# EAGLE schematic tyrmt (EAGLE 6.3)
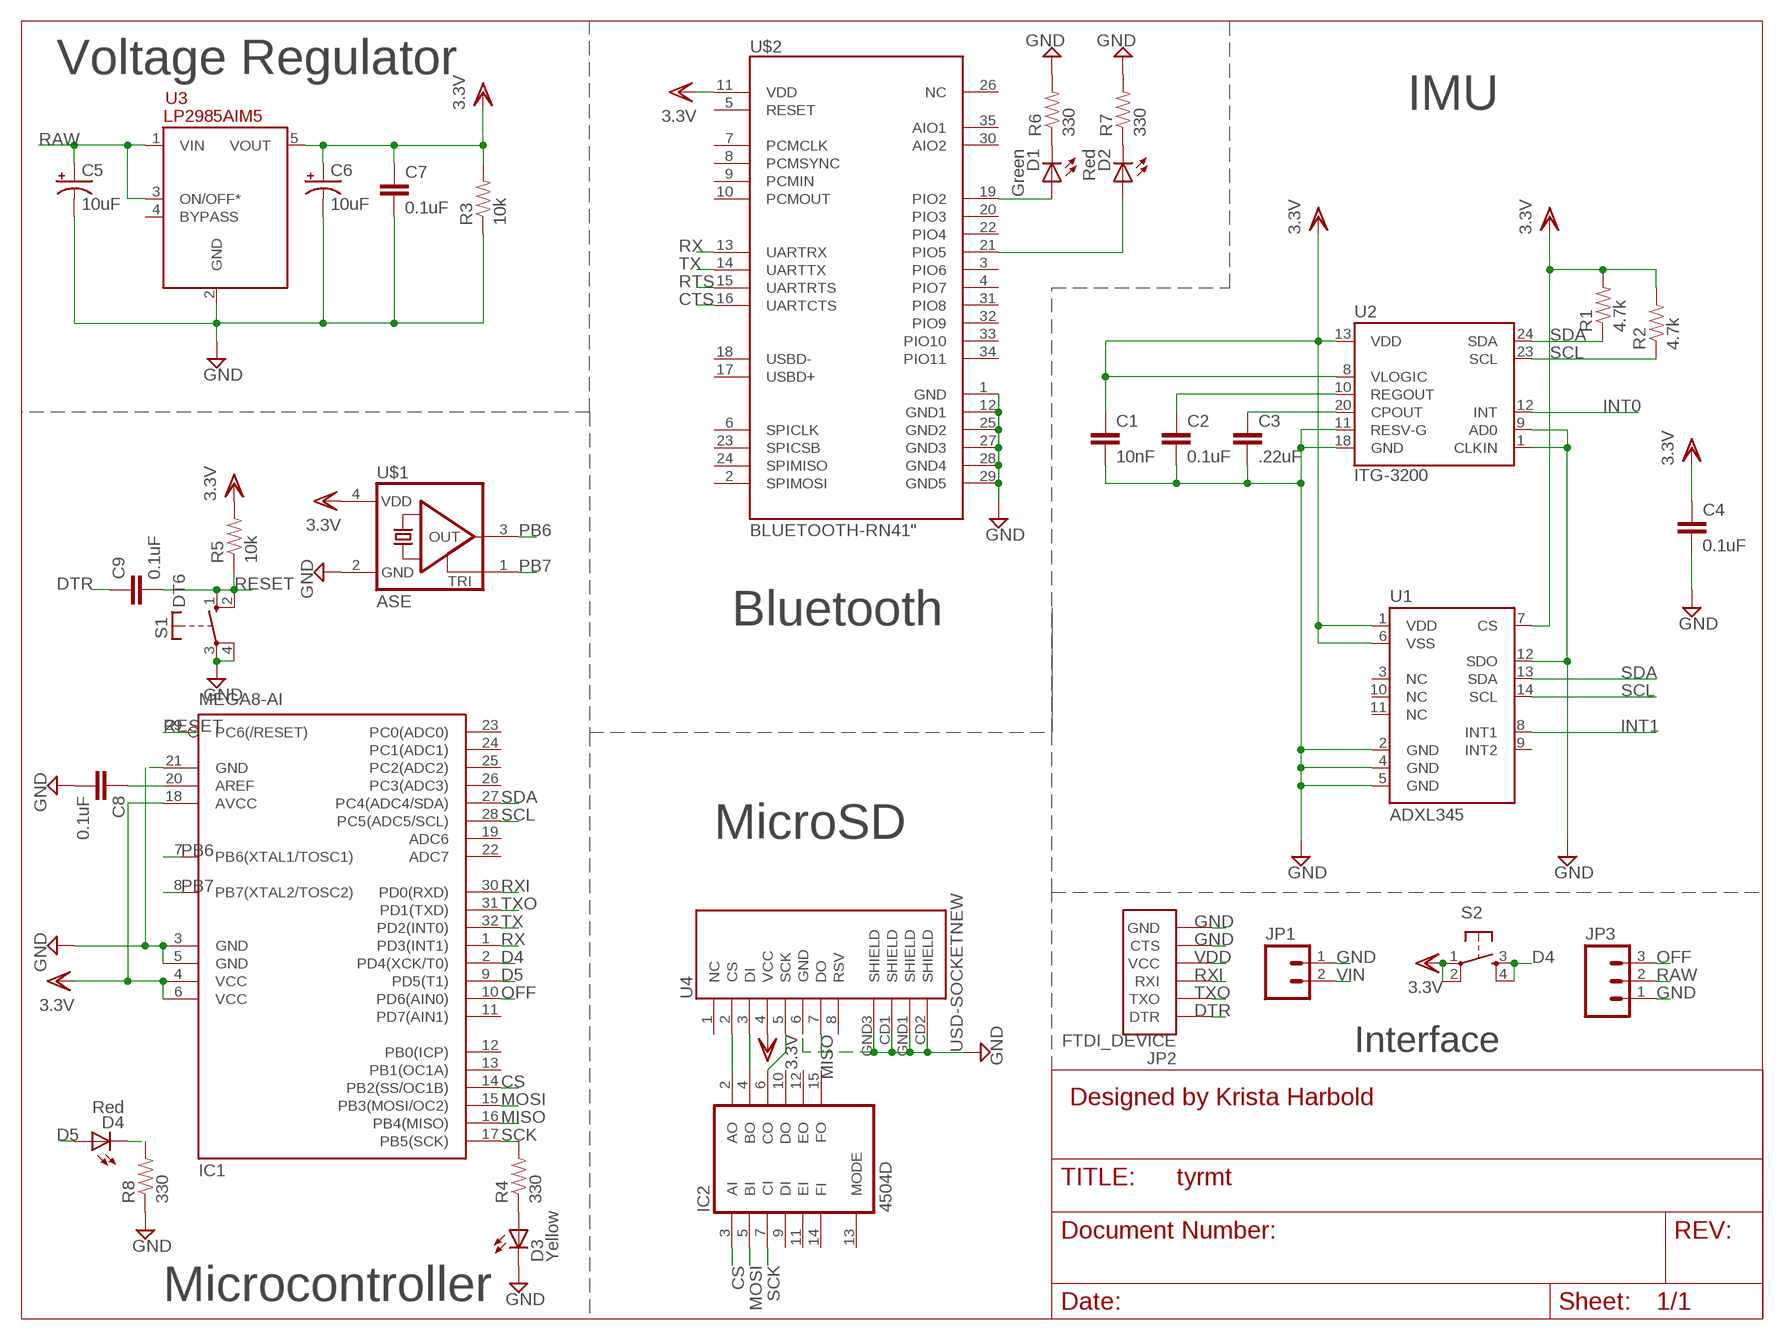
[diagram p0: schematic, sheet 1]

## Parts
C1  10nF  10NF-CER  [0402-CAP]
C2  0.1uF  .1UF-CER  [0402-CAP]
C3  .22uF  .22UF-CER  [0402-CAP]
C4  0.1uF  .1UF-CER  [0402-CAP]
C5  10uF  10UF-16V-10%(TANT)  [EIA3216]
C6  10uF  10UF-16V-10%(TANT)  [EIA3216]
C7  0.1uF  .1UF-CER  [0402-CAP]
C8  0.1uF  .1UF-CER  [0402-CAP]
C9  0.1uF  .1UF-CER  [0402-CAP]
D1  Green  SFH482  [SFH482]
D2  Red  SFH482  [SFH482]
D3  Yellow  SFH482  [SFH482]
D4  Red  SFH482  [SFH482]
IC1  MEGA8-AI  [TQFP32-08]
IC2  4504D  [SO16]
JP1  M02-JST-2MM-SMT  [JST-2-SMD]
JP2  FTDI_DEVICE  [FTDI_DEVICE_SIDE]
JP3  M03POLAR  [MOLEX-1X3]
R1  4.7k  RESISTOR0402-RES  [0402-RES]
R2  4.7k  RESISTOR0402-RES  [0402-RES]
R3  10k  RESISTOR0402-RES  [0402-RES]
R4  330  RESISTOR0402-RES  [0402-RES]
R5  10k  RESISTOR0402-RES  [0402-RES]
R6  330  RESISTOR0402-RES  [0402-RES]
R7  330  RESISTOR0402-RES  [0402-RES]
R8  330  RESISTOR0402-RES  [0402-RES]
S1  DT6  [DT6]
S2  TAC_SWITCHSMD  [TACTILE_SWITCH_SMD]
U1  ADXL345  [LGA14]
U2  ITG-3200  [QFN-24]
U3  LP2985AIM5  [SOT23-5L]
U4  USD-SOCKETNEW  [MICRO-SD-SOCKET-PP]
U$1  ASE  [ASE]
U$2  BLUETOOTH-RN41"  [RN41]

## Nets
1Y: IC2.2(AO) U4.2(CS)
2Y: IC2.4(BO) U4.3(DI)
3Y: IC2.6(CO) U4.5(SCK)
CS: IC1.14(PB2(SS/OC1B)) IC2.3(AI)
CTS: U$2.16(UARTCTS)
D4: IC1.2(PD4(XCK/T0)) S2.3 S2.4
D5: D4.A IC1.9(PD5(T1))
DTR: C9.1 JP2.P$1(DTR)
GND: C1.2 C2.2 C3.2 C4.2 C5.C(-) C6.C(-) C7.2 C8.2 D3.K(C) IC1.3(GND) IC1.5(GND) IC1.21(GND) JP1.1 JP2.P$5(CTS) JP2.P$6(GND) JP3.1 R3.1 R6.2 R7.2 R8.1 S1.3(P) S1.4(P) U1.2(GND) U1.4(GND) U1.5(GND) U1.12(SDO) U2.1(CLKIN) U2.9(AD0) U2.11(RESV-G) U2.18(GND) U3.2(GND) U4.6(GND) U4.CD1(SHIELD) U4.CD2(SHIELD) U4.GND1(SHIELD) U4.GND3(SHIELD) U$1.2(GND) U$2.1(GND) U$2.12(GND1) U$2.25(GND2) U$2.27(GND3) U$2.28(GND4) U$2.29(GND5)
INT0: U2.12(INT)
INT1: U1.8(INT1)
MISO: IC1.16(PB4(MISO)) U4.7(DO)
MOSI: IC1.15(PB3(MOSI/OC2)) IC2.5(BI)
N$1: C8.1 IC1.20(AREF)
N$2: C2.1 U2.10(REGOUT)
N$3: C3.1 U2.20(CPOUT)
N$5: D4.K(C) R8.2
N$6: D3.A R4.1
N$10: D2.K(C) R7.1
N$11: D2.A U$2.21(PIO5)
N$12: D1.K(C) R6.1
N$13: D1.A U$2.19(PIO2)
OFF: IC1.10(PD6(AIN0)) JP3.3
PB6: IC1.7(PB6(XTAL1/TOSC1)) U$1.3(OUT)
PB7: IC1.8(PB7(XTAL2/TOSC2)) U$1.1(TRI)
RAW: C5.A(+) JP3.2 U3.1(VIN) U3.3(ON/OFF*)
RESET: C9.2 IC1.29(PC6(/RESET)) R5.1 S1.1(S) S1.2(S)
RTS: U$2.15(UARTRTS)
RX: IC1.1(PD3(INT1)) U$2.13(UARTRX)
RXI: IC1.30(PD0(RXD)) JP2.P$3(RXI)
SCK: IC1.17(PB5(SCK)) IC2.7(CI) R4.2
SCL: IC1.28(PC5(ADC5/SCL)) R2.1 U1.14(SCL) U2.23(SCL)
SDA: IC1.27(PC4(ADC4/SDA)) R1.1 U1.13(SDA) U2.24(SDA)
TX: IC1.32(PD2(INT0)) U$2.14(UARTTX)
TXO: IC1.31(PD1(TXD)) JP2.P$2(TXO)
VDD: C1.1 C4.1 C6.A(+) C7.1 IC1.4(VCC) IC1.6(VCC) IC1.18(AVCC) JP2.P$4(VCC) R1.2 R2.2 R3.2 R5.2 S2.1 S2.2 U1.1(VDD) U1.6(VSS) U1.7(CS) U2.8(VLOGIC) U2.13(VDD) U3.5(VOUT) U4.4(VCC) U$1.4(VDD) U$2.11(VDD) ; supply symbol labelled 3.3V
VIN: JP1.2
Unconnected: IC1.11(PD7(AIN1)) IC1.12(PB0(ICP)) IC1.13(PB1(OC1A)) IC1.19(ADC6) IC1.22(ADC7) IC1.23(PC0(ADC0)) IC1.24(PC1(ADC1)) IC1.25(PC2(ADC2)) IC1.26(PC3(ADC3)) IC2.9(DI) IC2.10(DO) IC2.11(EI) IC2.12(EO) IC2.13(MODE) IC2.14(FI) IC2.15(FO) U1.3(NC) U1.9(INT2) U1.10(NC) U1.11(NC) U3.4(BYPASS) U4.1(NC) U4.8(RSV) U$2.2(SPIMOSI) U$2.3(PIO6) U$2.4(PIO7) U$2.5(RESET) U$2.6(SPICLK) U$2.7(PCMCLK) U$2.8(PCMSYNC) U$2.9(PCMIN) U$2.10(PCMOUT) U$2.17(USBD+) U$2.18(USBD-) U$2.20(PIO3) U$2.22(PIO4) U$2.23(SPICSB) U$2.24(SPIMISO) U$2.26(NC) U$2.30(AIO2) U$2.31(PIO8) U$2.32(PIO9) U$2.33(PIO10) U$2.34(PIO11) U$2.35(AIO1)

## Notes on the sheet
- Voltage Regulator
- IMU
- Bluetooth
- MicroSD
- Interface
- Designed by Krista Harbold
- Microcontroller

## Power pins joined to a net without a drawn wire
GND: IC2.8(GND)
VCC: IC2.1(VCC)
VDD: IC2.16(VDD)

## Library data of the parts
C1 = SparkFun-Capacitors:10NF-CER: 10nF/.01uF/10000pF ceramic SMT CAP-00867- 50V 10% (0603); PROD_ID: CAP-00867
C2 C4 C7-C9 = SparkFun-Capacitors:.1UF-CER: .1uF ceramic SMT CAP-00810- 25V +80%/-20% (0603) CAP-08390- 100V 10% (0603) CAP-08604- 25V 5% (0603); PROD_ID: CAP-00810
C3 = SparkFun-Capacitors:.22UF-CER: .22uF ceramic SMT CAP-09885- 50V +80%/-20% (0603); PROD_ID: CAP-09885
C5 C6 = SparkFun-Capacitors:10UF-16V-10%(TANT): CAP-00811 1206/EIA-3216 Tantalum capacitor; PROD_ID: CAP-00811
D1-D4 = led:SFH482: IR LED infrared emitting diode, Infineon
IC1 = atmel:MEGA8: MICROCONTROLLER 8 Kbytes FLASH, 1 kbytes SRAM, 512 bytes EEPROM, USART, 6-channel 10 bit ADC, 2-channel 8 bit ADC Pin compatible with Atmega48, ATMega88, ATMega168 Source: avr.lbr; MPN: ATMEGA8-16AU; OC_FARNELL: 9171371; OC_NEWARK: 73M8863
IC2 = 45xx:4504: TTL or CMOS to CMOS hex LEVEL SHIFTER
JP1 = SparkFun-Connectors:M02: Header 2 Standard 2-pin 0.1" header. Use with straight break away headers (SKU : PRT-00116), right angle break away headers (PRT-00553), swiss pins (PRT-00743), machine pins (PRT-00117), and female headers (PRT-00115). Molex polarized connector foot print use with SKU : PRT-08233 with associated crimp pins and housings.; PROD_ID: CONN-08352
JP2 = SparkFun-Connectors:FTDI_DEVICE: Connector which mates to FTDI basic or FTDI cable.
JP3 = SparkFun-Connectors:M03: Header 3 Standard 3-pin 0.1" header. Use with straight break away headers (SKU : PRT-00116), right angle break away headers (PRT-00553), swiss pins (PRT-00743), machine pins (PRT-00117), and female headers (PRT-00115). Molex polarized connector foot print use with SKU : PRT-08232 with associated crimp pins and housings.
R1-R8 = SparkFun-Resistors:RESISTOR: Resistor Basic schematic elements and footprints for 0603, 1206, and PTH resistors.
S1 = switch-misc:DT: ITT SWITCH
S2 = SparkFun-Electromechanical:TAC_SWITCH: Momentary Switch Button commonly used for reset or general input. Spark Fun Electronics SKU : COM-00097 SMT- SWCH-08247; PROD_ID: SWCH-08247
U1 = SparkFun-Sensors:ADXL345: 3-axis SPI/I2C 2/4/8/16g accelerometer
U2 = SparkFun-Sensors:ITG-3200: ITG-3200 3-axis gyro, digital output, qfn24 package
U3 = 0-svo-lp2981:LP2985*: Micropower 150 mA Low-Noise Ultra Low-Dropout Regulator in SOT-23 and micro SMD Packages Designed for Use with Very Low ESR Output Capacitors
U4 = SparkFun-Connectors:USD-SOCKET: microSD Socket Push-push type uSD socket. Schematic element and footprint production proven. Spark Fun Electronics SKU : PRT-00127. tDoc lines correctly indicate media card edge positions when inserting (unlocked, locked, depressed).
U$1 = crystal:ASE: 3.3Vdc CMOS SMD CRYSTAL CLOCK OSCILLATOR SOurce: www.abracon.com; OC_FARNELL: unknown; OC_NEWARK: unknown
U$2 = SparkFun-RF:BLUETOOTH-RN41: Bluetooth SMD module